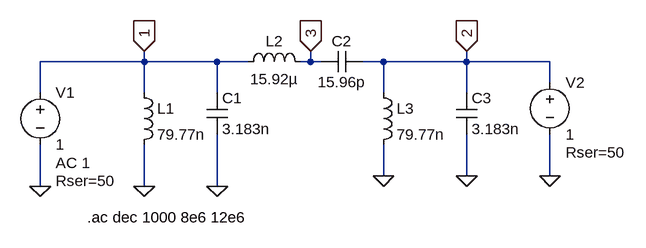
[diagram p0: schematic BPF_two_port.asc]
BPF_two_port.asc, the LTspice schematic file:
Version 4
SHEET 1 880 680
WIRE 16 96 16 80
WIRE 16 96 -144 96
WIRE 128 96 16 96
WIRE 176 96 128 96
WIRE 272 96 272 80
WIRE 272 96 256 96
WIRE 288 96 272 96
WIRE 384 96 352 96
WIRE 512 96 512 80
WIRE 512 96 384 96
WIRE 640 96 512 96
WIRE 640 128 640 96
WIRE -144 144 -144 96
WIRE 16 144 16 96
WIRE 128 144 128 96
WIRE 384 144 384 96
WIRE 512 144 512 96
WIRE 384 272 384 224
WIRE 512 272 512 208
WIRE 640 272 640 208
WIRE -144 288 -144 224
WIRE 16 288 16 224
WIRE 128 288 128 208
FLAG -144 288 0
FLAG 16 288 0
FLAG 128 288 0
FLAG 384 272 0
FLAG 512 272 0
FLAG 640 272 0
FLAG 16 80 1
IOPIN 16 80 In
FLAG 512 80 2
IOPIN 512 80 In
FLAG 272 80 3
IOPIN 272 80 In
SYMBOL ind 0 128 R0
SYMATTR InstName L1
SYMATTR Value 79.77n
SYMBOL ind 160 112 R270
WINDOW 0 32 56 VTop 2
WINDOW 3 5 56 VBottom 2
SYMATTR InstName L2
SYMATTR Value 15.92µ
SYMBOL ind 368 128 R0
SYMATTR InstName L3
SYMATTR Value 79.77n
SYMBOL cap 112 144 R0
SYMATTR InstName C1
SYMATTR Value 3.183n
SYMBOL cap 352 80 R90
WINDOW 0 0 32 VBottom 2
WINDOW 3 32 32 VTop 2
SYMATTR InstName C2
SYMATTR Value 15.96p
SYMBOL cap 496 144 R0
SYMATTR InstName C3
SYMATTR Value 3.183n
SYMBOL voltage -144 128 R0
WINDOW 123 24 124 Left 2
WINDOW 39 24 152 Left 2
SYMATTR InstName V1
SYMATTR Value 1
SYMATTR Value2 AC 1
SYMATTR SpiceLine Rser=50
SYMBOL voltage 640 112 R0
WINDOW 123 0 0 Left 0
WINDOW 39 24 124 Left 2
SYMATTR InstName V2
SYMATTR Value 1
SYMATTR SpiceLine Rser=50
TEXT -72 336 Left 2 !.ac dec 1000 8e6 12e6

The netlist it stands for:
* BPF_two_port.asc
L1 1 0 79.77n
L2 1 3 15.92µ
L3 2 0 79.77n
C1 1 0 3.183n
C2 2 3 15.96p
C3 2 0 3.183n
V1 1 0 1 AC 1 Rser=50
V2 2 0 1 Rser=50
.ac dec 1000 8e6 12e6
.backanno
.end